# EAGLE design Transformer less 5v 100mA (EAGLE 9.6.2)
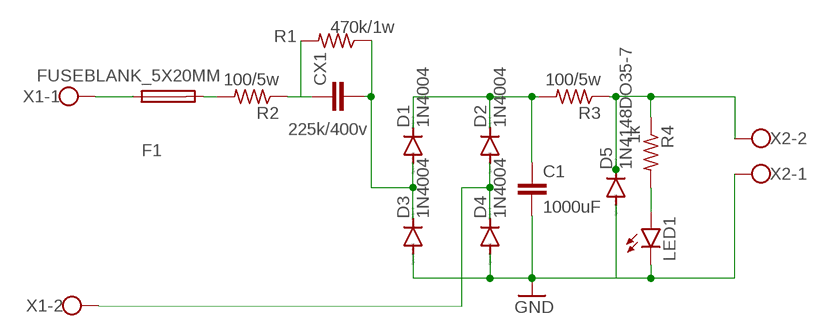
[diagram p0: schematic, sheet 1]

## Parts
C1  1000uF  C-EU025-060X050  [C025-060X050]
CX1  225k/400v  CXXC15B10  [XC15B10]
D1  1N4004  [DO41-10]
D2  1N4004  [DO41-10]
D3  1N4004  [DO41-10]
D4  1N4004  [DO41-10]
D5  1N4148DO35-7  [DO35-7]
F1  FUSEBLANK_5X20MM  [FUSE_HOLDER_5X20MM]
LED1  LED5MM  [LED5MM]
R1  470k/1w  R-US_0414/15  [0414/15]
R2  100/5w  R-US_0617/22  [0617/22]
R3  100/5w  R-US_0617/22  [0617/22]
R4  1k  R-US_0207/7  [0207/7]
X1  W237-102  [W237-102]
X2  W237-102  [W237-102]

## Nets
GND: C1.2 D3.A D4.A D5.A LED1.K(C) X2.1
N$1: F1.1 X1.1
N$2: F1.2 R2.2
N$3: CX1.1 R1.2 R2.1
N$4: C1.1 D1.C D2.C R3.2
N$8: D5.C R3.1 R4.1 X2.2
N$9: CX1.2 D1.A D3.C R1.1
N$10: LED1.A R4.2
N$11: D2.A D4.C X1.2

## Library data of the parts
C1 = rcl:C-EU: CAPACITOR, European symbol; SPICEPREFIX: C
CX1 = rcl:CX: X CAPACITOR for power line; SPICEPREFIX: C
D1-D4 = diode:1N4004: DIODE general purpose rectifier, 1 A
D5 = diode:1N4148: DIODE high speed (Philips)
F1 = fuse:FUSE: Fuse; OC_FARNELL: unknown; OC_NEWARK: unknown
LED1 = led:LED: LED OSRAM: - CHIPLED LG R971, LG N971, LY N971, LG Q971, LY Q971, LO R971, LY R971 LH N974, LH R974 LS Q976, LO Q976, LY Q976 LO Q996 - Hyper CHIPLED LW Q18S LB Q993, LB Q99A, LB R99A - SideLED LS A670, LO A670, LY A670, LG A670, LP A670 LB A673, LV A673, LT A673, LW A673 LH A674 LY A675 LS A676, LA A676, LO A676, LY A676, LW A676 LS A679, LY A679, LG A679 - Hyper Micro SIDELED® LS Y876, LA Y876, LO Y876, LY Y876 LT Y87S - SmartLED LW L88C, LW L88S LB L89C, LB L89S, LG L890 LS L89K, LO L89K, LY L89K LS L896, LA L896, LO L896, LY L896 - TOPLED LS T670, LO T670, LY T670, LG T670, LP T670 LSG T670, LSP T670, LSY T670, LOP T670, LYG T670 LG T671, LOG T671, LSG T671 LB T673, LV T673, LT T673, LW T673 LH T674 LS T676, LA T676, LO T676, LY T676, LB T676, LH T676, LSB T676, LW T676 LB T67C, LV T67C, LT T67C, LS T67K, LO T67K, LY T67K, LW E67C LS E67B, LA E67B, LO E67B, LY E67B, LB E67C, LV E67C, LT E67C LW T67C LS T679, LY T679, LG T679 LS T770, LO T770, LY T770, LG T770, LP T770 LB T773, LV T773, LT T773, LW T773 LH T774 LS E675, LA E675, LY E675, LS T675 LS T776, LA T776, LO T776, LY T776, LB T776 LHGB T686 LT T68C, LB T68C - Hyper Mini TOPLED® LB M676 - Mini TOPLED Santana® LG M470 LS M47K, LO M47K, LY M47K Source: http://www.osram.convergy.de LUXEON: - LUMILED® LXK2-PW12-R00, LXK2-PW12-S00, LXK2-PW14-U00, LXK2-PW14-V00 LXK2-PM12-R00, LXK2-PM12-S00, LXK2-PM14-U00 LXK2-PE12-Q00, LXK2-PE12-R00, LXK2-PE12-S00, LXK2-PE14-T00, LXK2-PE14-U00 LXK2-PB12-K00, LXK2-PB12-L00, LXK2-PB12-M00, LXK2-PB14-N00, LXK2-PB14-P00, LXK2-PB14-Q00 LXK2-PR12-L00, LXK2-PR12-M00, LXK2-PR14-Q00, LXK2-PR14-R00 LXK2-PD12-Q00, LXK2-PD12-R00, LXK2-PD12-S00 LXK2-PH12-R00, LXK2-PH12-S00 LXK2-PL12-P00, LXK2-PL12-Q00, LXK2-PL12-R00 Source: www.luxeon.com KINGBRIGHT: KA-3528ASYC Source: www.kingbright.com
R1-R4 = rcl:R-US_: RESISTOR, American symbol; SPICEPREFIX: R
X1 X2 = con-wago-500:W237-102: WAGO SCREW CLAMP; MPN: 237-102; OC_FARNELL: unknown; OC_NEWARK: 70K9898

## Board
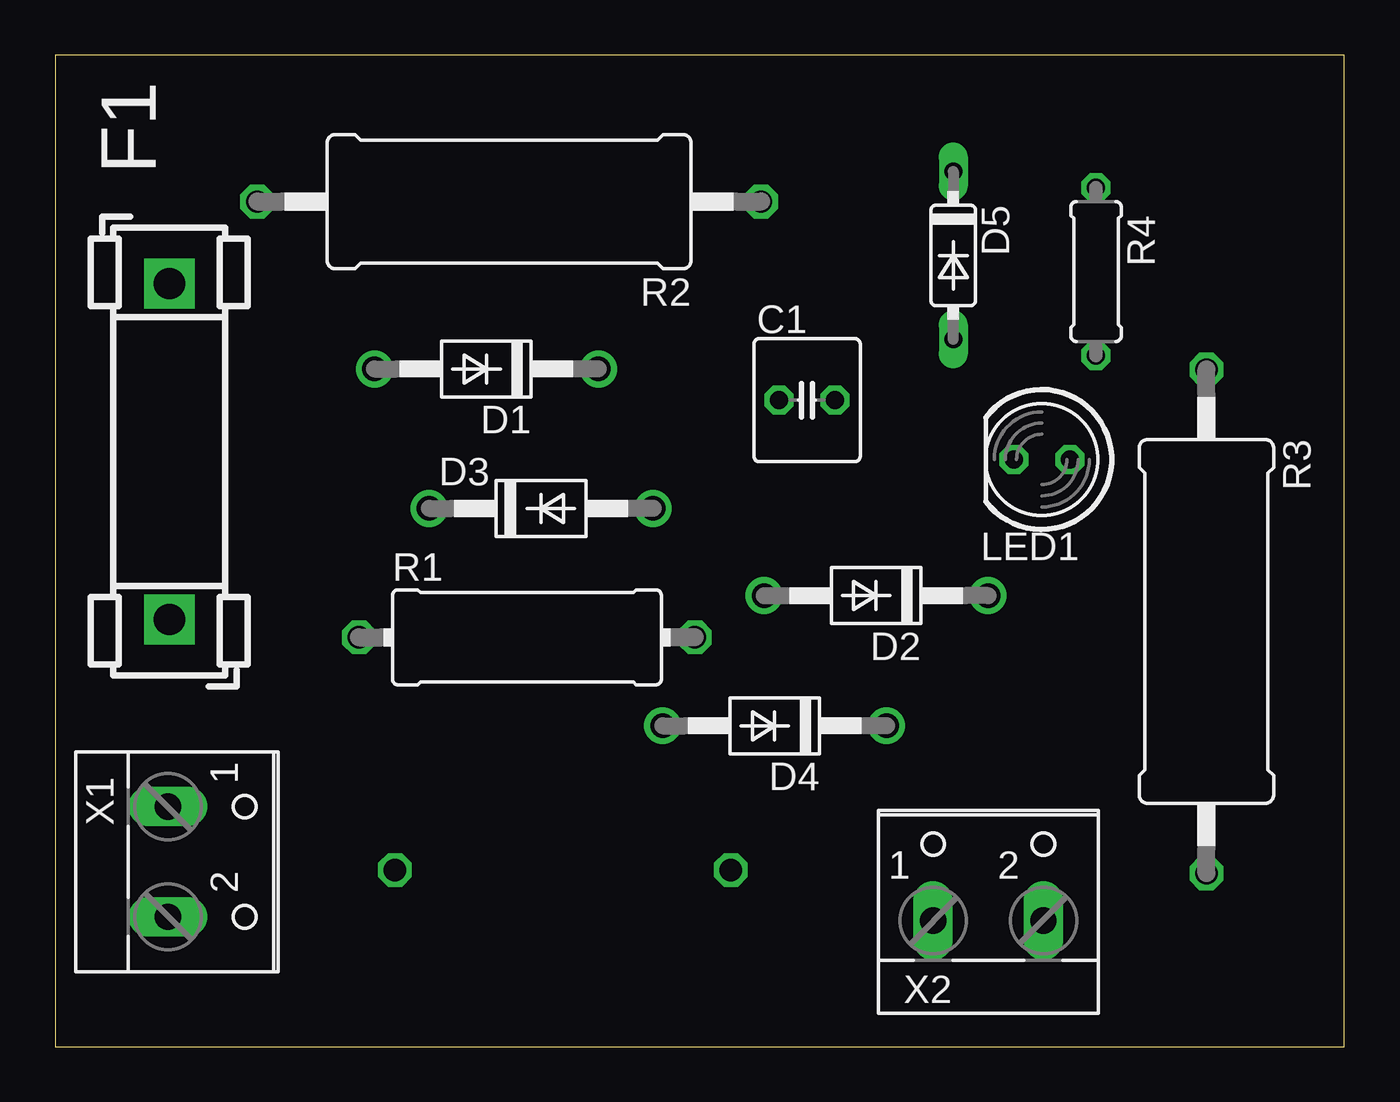
[diagram p1: board, top side]
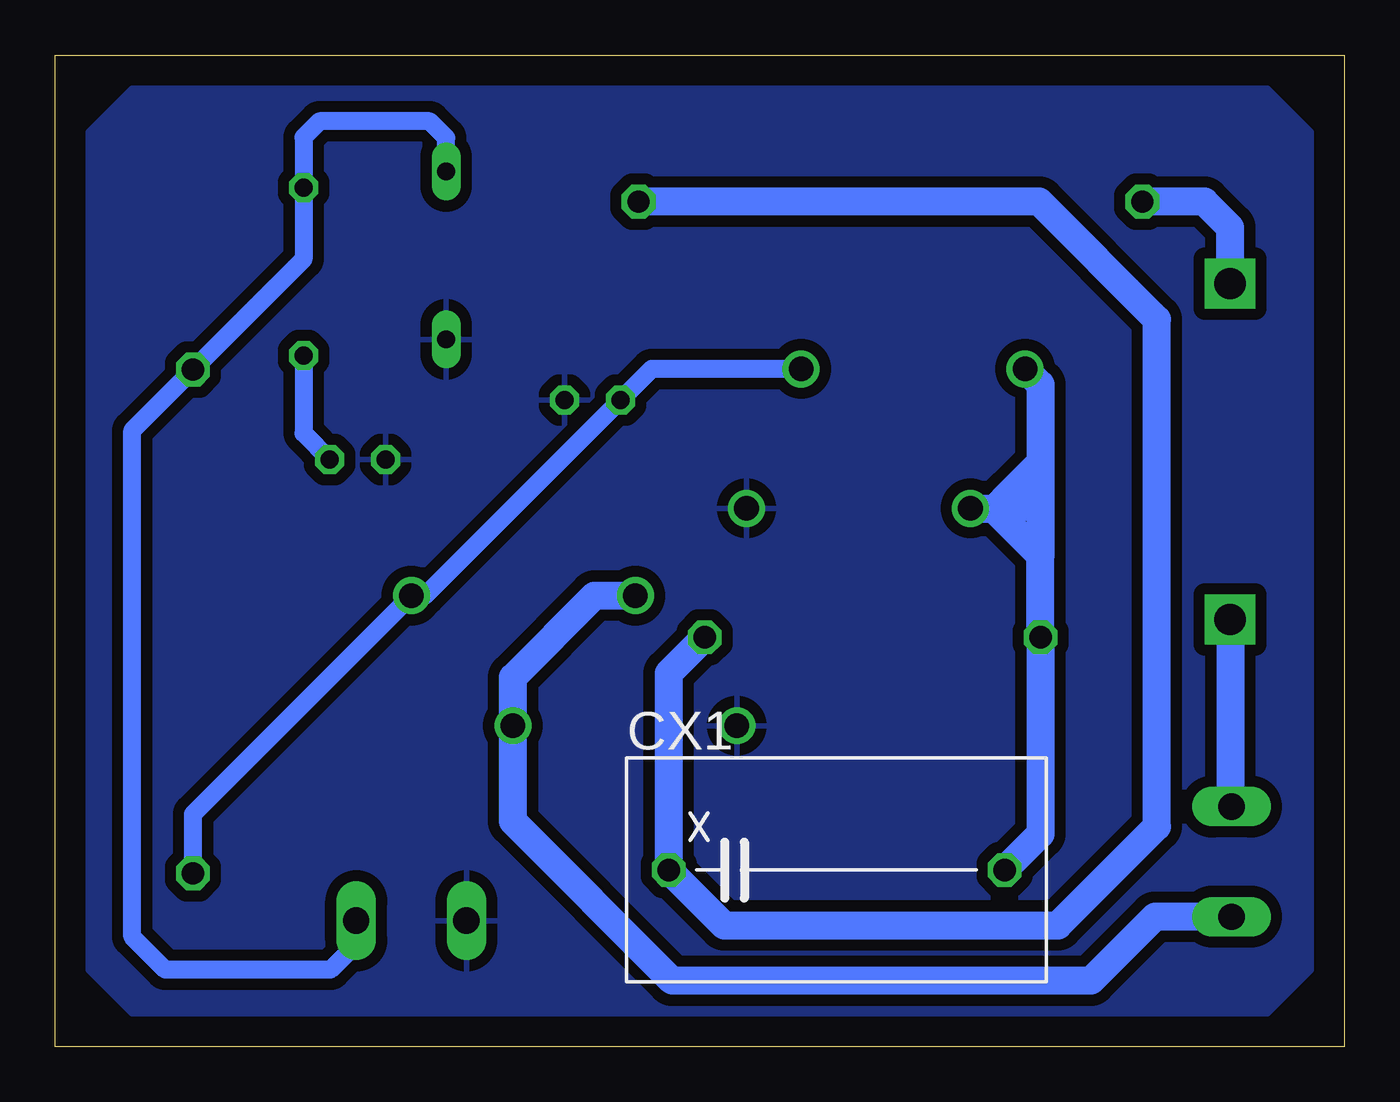
[diagram p2: board, bottom side, seen from below]

Size 58.5 x 45 mm. Coordinates in mm from the lower left corner, seen from the top.
Outline: 0,0 58.5,0 58.5,45 0,45 0,0
Copper layers (1*16): Top 0.035mm / dielectric 1.5mm / Bottom 0.035mm
Design rules "default *": minimum track width 6mil, minimum drill 0.35mm, track to track 20mil, track to pad 20mil, pad to pad 20mil, via to via 20mil, smd to smd 6mil, copper to edge 40mil, drill to drill 6mil, minimum pad ring 10mil, minimum via ring 8mil, stop-mask expansion 4mil, vias tented up to drill 0mil, thermal gap 20mil

### Footprints (pad centres in the part's own frame; a part is rotated, then mirrored left to right if it is on the bottom)
C025-060X050 = drill 0.813 octagon: 1 -1.27,0; 2 1.27,0
XC15B10 = drill 1.016 octagon: 1 -7.62,0; 2 7.62,0
DO41-10 = drill 1.118: A 5.08,0; C -5.08,0
DO35-7 = drill 0.813 long: A 3.81,0; C -3.81,0
FUSE_HOLDER_5X20MM = drill 1.422 pad 2.286 square: 1 0,0; 2 15.24,0
LED5MM = drill 0.813 octagon: A -1.27,0; K 1.27,0
0414/15 = drill 1.016 octagon: 1 -7.62,0; 2 7.62,0
0617/22 = drill 1.016 octagon: 1 -11.43,0; 2 11.43,0
0207/7 = drill 0.813 octagon: 1 -3.81,0; 2 3.81,0
W237-102 = drill 1.194 long: 1 -2.5,-1.27; 2 2.5,-1.27

### Placement (x,y rotation side)
C1  34.12,29.34 0 top
CX1  23.04,8.02 0 bottom
D1  19.57,30.76 180 top
D2  37.25,20.47 180 top
D3  22.05,24.43 0 top
D4  32.65,14.57 180 top
D5  40.75,35.91 270 top
F1  5.18,19.39 90 top
LED1  44.77,26.65 180 top
R1  21.41,18.58 0 top
R2  20.6,38.35 180 top
R3  52.24,19.3 270 top
R4  47.23,35.18 270 top
X1  6.39,8.4 270 top
X2  42.34,6.99 0 top

### Tracks (layer width: path | path; a pad name or v marks a point on that pad's centre or on a via)
GND
  pour Bottom: 1.5,41.5 3.5,43.5 55,43.5 57,41.5 57,3.5 55,1.5 3.5,1.5 1.5,3.5
N$1
  Bottom 1.27: F1.1 5.18,10.96 X1.1
N$2
  Bottom 1.27: F1.2 5.18,37.18 6.35,38.35 R2.2
N$3
  Bottom 1.27: R2.1 13.85,38.35 8.5,33 8.5,10 13,5.5 28.14,5.5 CX1.1 30.66,16.95 R1.2
N$4
  Bottom 0.813: D1.C 31.43,30.76 C1.1 41.72,20.47 D2.C 52.24,10.56 R3.2
N$8
  Bottom 0.813: X2.2 44.84,4.66 46,3.5 53.5,3.5 55,5 55,27.97 R3.1 47.23,35.74 R4.1 47.23,41.27 46.5,42 41.5,42 40.75,41.25 D5.C
N$9
  Bottom 1.27: 13.79,22.29 R1.1 13.79,9.65 CX1.2 | 13.79,22.29 15.93,24.43 D3.C 15.86,24.43 15.14,25.14 | D1.A 13.79,30.06 13.79,26.5 | 13.79,26.5 13.79,22.29 | 15.14,25.14 13.79,26.5 | 15.14,25.14 14.5,24.5
N$10
  Bottom 0.813: R4.2 47.23,27.84 LED1.A
N$11
  Bottom 1.27: X1.2 8.6,5.9 11.5,3 30.5,3 37.73,10.23 D4.C 37.73,16.77 34.03,20.47 D2.A